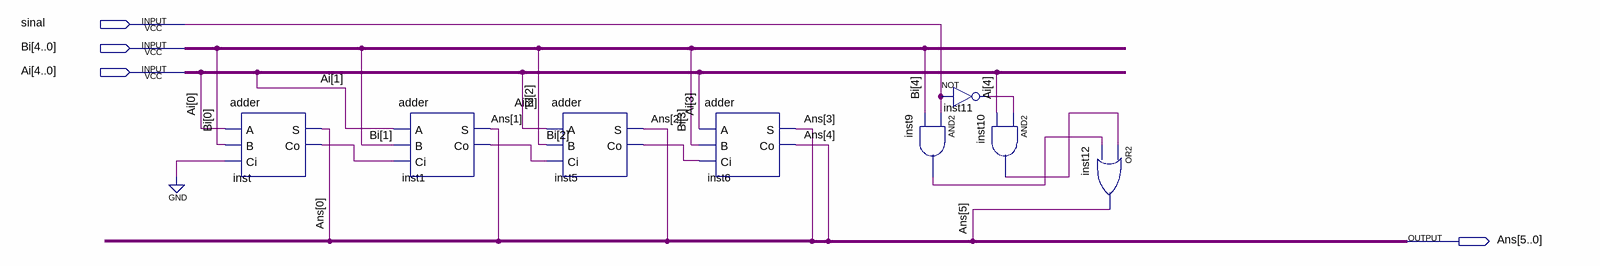
[diagram p0: schematic sheet]
// Quartus schematic full_adder.bdf as structural Verilog: 8 symbols, 4 pins
module full_adder (
  input  sinal,
  input  [4:0] Bi,
  input  [4:0] Ai,
  output [5:0] Ans
);

  wire inst1_co, inst5_co, inst9_out, inst10_out, inst11_out, inst_co;

  adder inst (.A(Ai[0]), .B(Bi[0]), .Ci(1'b0), .S(Ans[0]), .Co(inst_co));
  adder inst1 (.A(Ai[1]), .B(Bi[1]), .Ci(inst_co), .S(Ans[1]), .Co(inst1_co));
  adder inst5 (.A(Ai[2]), .B(Bi[2]), .Ci(inst1_co), .S(Ans[2]), .Co(inst5_co));
  adder inst6 (.A(Ai[3]), .B(Bi[3]), .Ci(inst5_co), .S(Ans[3]), .Co(Ans[4]));
  and inst9 (inst9_out, sinal, Bi[4]);
  not inst11 (inst11_out, sinal);
  and inst10 (inst10_out, inst11_out, Ai[4]);
  or inst12 (Ans[5], inst10_out, inst9_out);
endmodule
